# EAGLE design Board_2550 (EAGLE 7.6.0)
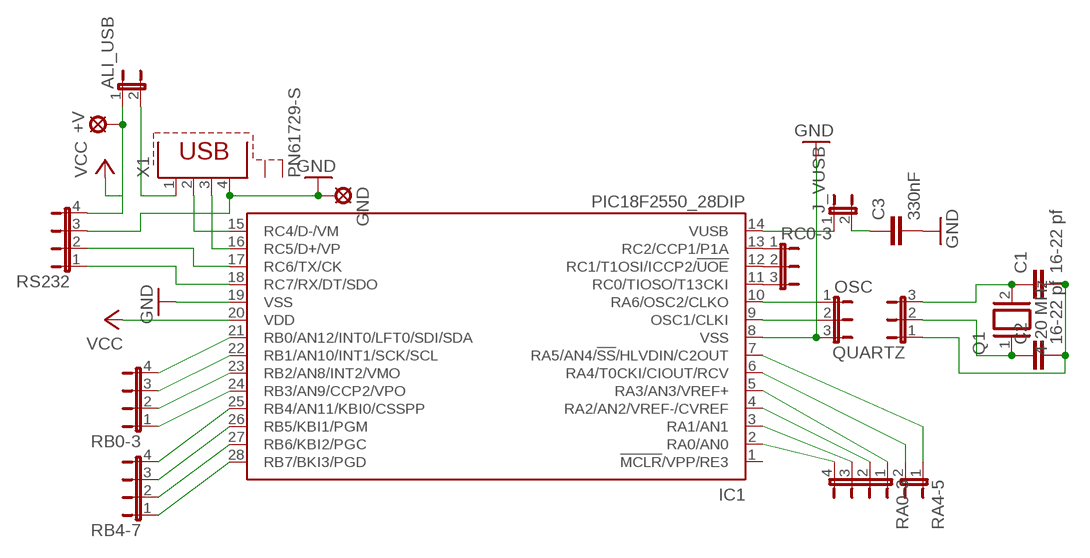
[diagram p0: schematic, sheet 1]

## Parts
+V  SE14  [SE14]
ALI_USB  JP1E  [JP1]
C1  16-22 pf  C-EU025-024X044  [C025-024X044]
C2  16-22 pf  C-EU025-024X044  [C025-024X044]
C3  330nF  C-EU025-024X044  [C025-024X044]
GND  SE14  [SE14]
IC1  PIC18F2550_28DIP  [DIL28-3]
J_VUSB  JP1E  [JP1]
OSC  JP2E  [JP2]
Q1  4-20 MHz  XTAL  [Q]
QUARTZ  JP2W  [JP2W]
RA0-3  JP4E  [JP4]
RA4-5  JP1E  [JP1]
RB0-3  JP4E  [JP4]
RB4-7  JP4E  [JP4]
RC0-3  JP2E  [JP2]
RS232  JP4E  [JP4]
X1  PN61729-S  [PN61729-S]

## Nets
GND: C3.2 GND.MP IC1.8(VSS) IC1.19(VSS) OSC.3 RS232.3 X1.4
N$1: IC1.10(RA6/OSC2/CLKO) OSC.1
N$2: IC1.9(OSC1/CLKI) OSC.2
N$3: IC1.15(RC4/D-/VM) X1.2
N$4: C1.1 Q1.2 QUARTZ.3
N$5: C2.1 Q1.1 QUARTZ.2
N$6: IC1.6(RA4/T0CKI/CIOUT/RCV) RA4-5.2
N$7: IC1.16(RC5/D+/VP) X1.3
N$8: IC1.5(RA3/AN3/VREF+) RA0-3.1
N$9: IC1.4(RA2/AN2/VREF-/CVREF) RA0-3.2
N$10: IC1.17(RC6/TX/CK) RS232.2
N$11: IC1.18(RC7/RX/DT/SDO) RS232.1
N$12: IC1.24(RB3/AN9/CCP2/VPO) RB0-3.1
N$13: IC1.23(RB2/AN8/INT2/VMO) RB0-3.2
N$14: IC1.22(RB1/AN10/INT1/SCK/SCL) RB0-3.3
N$15: IC1.21(RB0/AN12/INT0/LFT0/SDI/SDA) RB0-3.4
N$16: IC1.28(RB7/BKI3/PGD) RB4-7.1
N$17: IC1.27(RB6/KBI2/PGC) RB4-7.2
N$18: IC1.26(RB5/KBI1/PGM) RB4-7.3
N$19: IC1.25(RB4/AN11/KBI0/CSSPP) RB4-7.4
N$20: IC1.3(RA1/AN1) RA0-3.3
N$21: IC1.2(RA0/AN0) RA0-3.4
N$22: IC1.7(RA5/AN4/!SS!/HLVDIN/C2OUT) RA4-5.1
N$23: C1.2 C2.2 QUARTZ.1
N$24: +V.MP ALI_USB.1 IC1.20(VDD) RS232.4 ; supply symbol labelled VCC
N$25: IC1.13(RC2/CCP1/P1A) RC0-3.1
N$26: IC1.12(RC1/T1OSI/ICCP2/!UOE) RC0-3.2
N$27: IC1.11(RC0/TIOSO/T13CKI) RC0-3.3
N$28: C3.1 J_VUSB.2
N$29: IC1.14(VUSB) J_VUSB.1
N$30: ALI_USB.2 X1.1
Unconnected: IC1.1(!MCLR!/VPP/RE3) X1.S1 X1.S2

## Library data of the parts
+V GND = solpad:SE14: SOLDER PAD E1553, drill 1,4mm, distributor Buerklin, 07F820
ALI_USB J_VUSB RA4-5 = jumper:JP1E: JUMPER
C1-C3 = rcl:C-EU: CAPACITOR, European symbol
IC1 = microchip:PIC18F2*_28: USB Microcontrollers with nanoWatt Technology High-Performance, Enhanced Flash, 28/40/44-Pin, Source: http://ww1.microchip.com/downloads/en/devicedoc/39632c.pdf; MF: MICROCHIP; MPN: PIC18F2550-I/SP; OC_FARNELL: 1523822; OC_NEWARK: 80K6054
OSC RC0-3 = jumper:JP2E: JUMPER
Q1 = special:XTAL: CRYSTAL
QUARTZ = jumper:JP2W: JUMPER
RA0-3 RB0-3 RB4-7 RS232 = jumper:JP4E: JUMPER
X1 = con-berg:PN61729-S: BERG USB connector; OC_FARNELL: unknown; OC_NEWARK: unknown

## Board
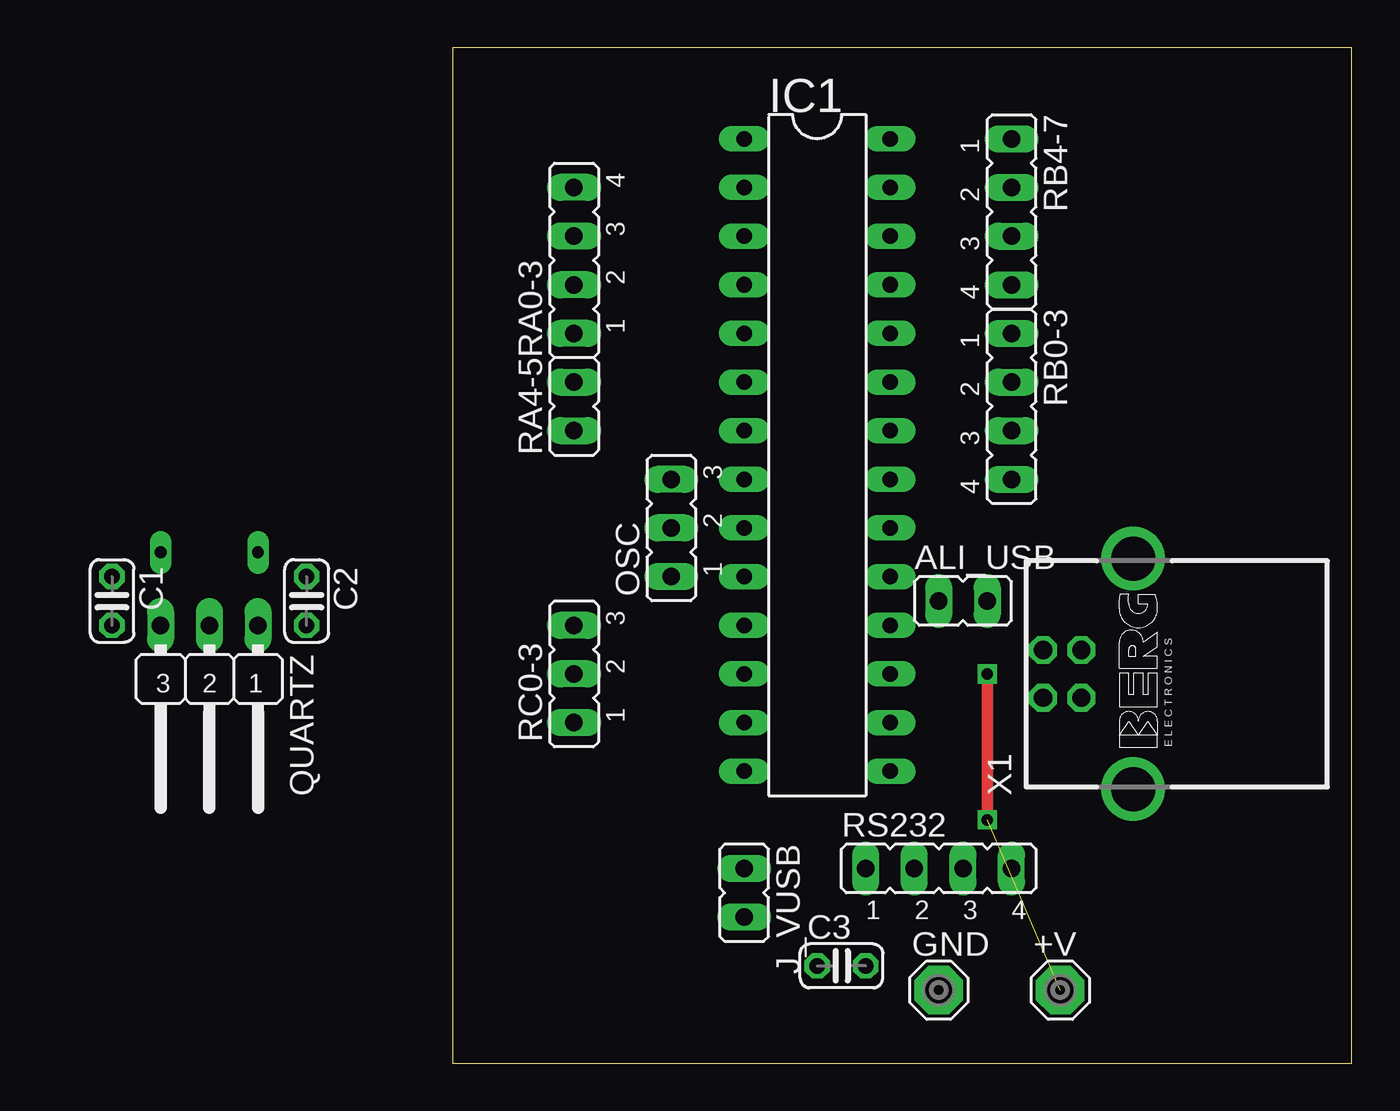
[diagram p1: board, top side]
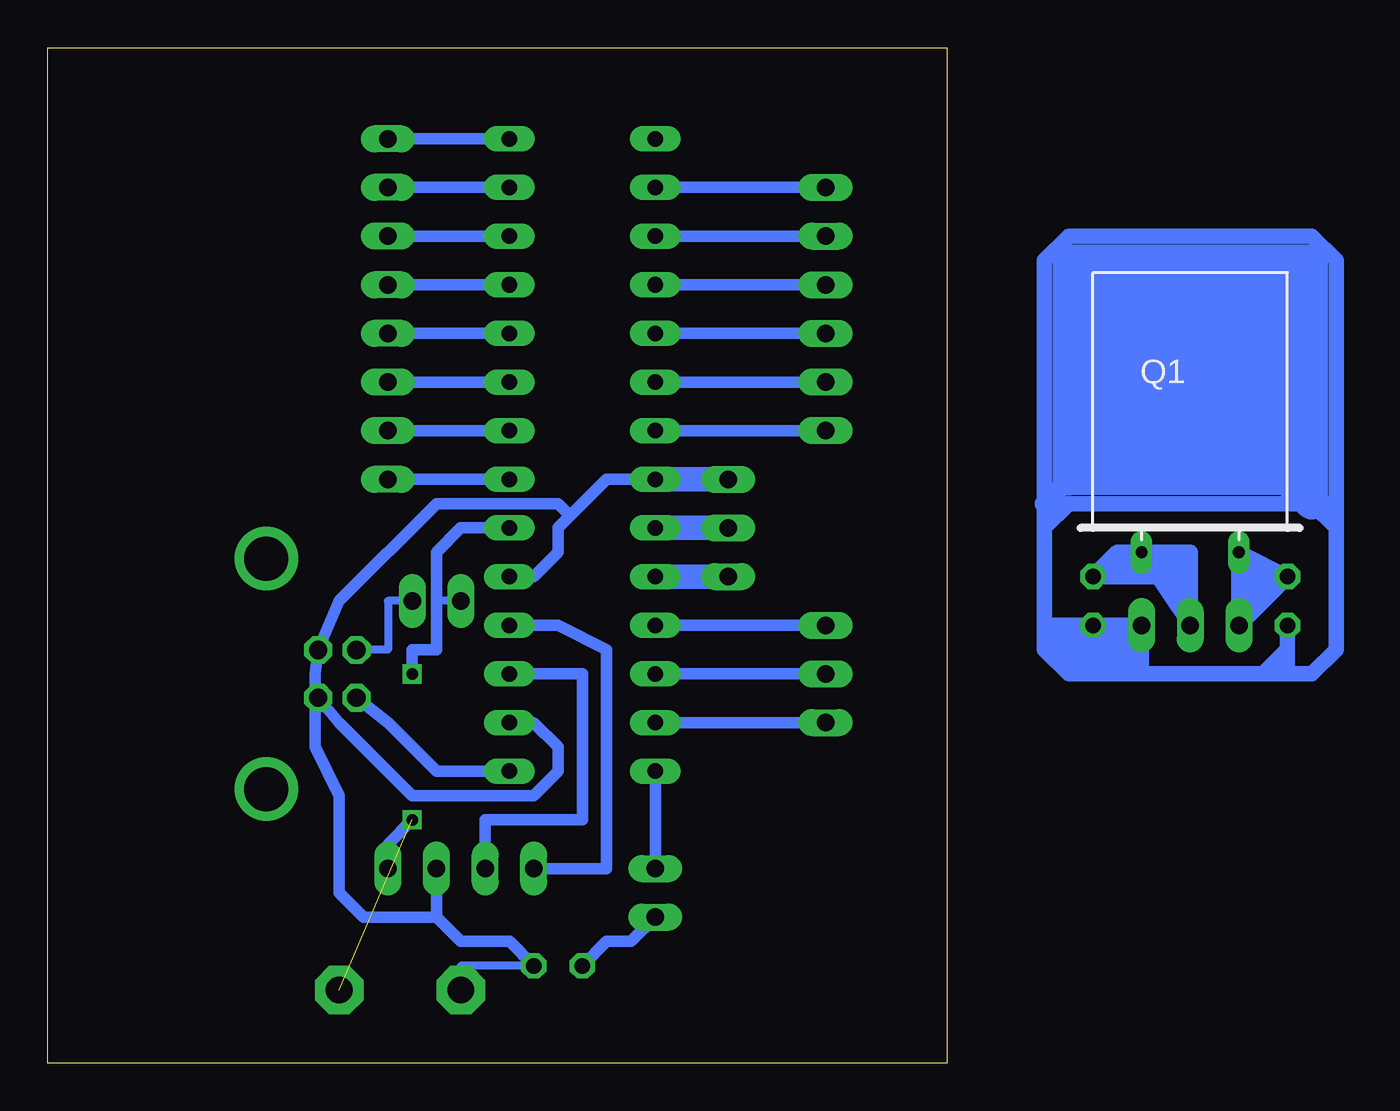
[diagram p2: board, bottom side, seen from below]

Size 46.97 x 53.01 mm. Coordinates in mm from the lower left corner, seen from the top.
Outline: 0,0 46.97,0 46.97,53.01 0,53.01 0,0
Copper layers (1*16): Top 0.035mm / dielectric 1.5mm / Bottom 0.035mm
Design rules "default": minimum track width 10mil, minimum drill 24mil, track to track 8mil, track to pad 8mil, pad to pad 8mil, via to via 8mil, smd to smd 8mil, copper to edge 40mil, drill to drill 8mil, minimum pad ring 10mil, minimum via ring 8mil, stop-mask expansion 4mil, vias tented up to drill 0mil, thermal gap 10mil

### Footprints (pad centres in the part's own frame; a part is rotated, then mirrored left to right if it is on the bottom)
SE14 = drill 1.397 pad 2.54 octagon: MP 0,0
JP1 = drill 0.914 long: 1 0,-1.27; 2 0,1.27
C025-024X044 = drill 0.813 octagon: 1 -1.27,0; 2 1.27,0
DIL28-3 = drill 0.813 long: 1 -16.51,-3.81; 2 -13.97,-3.81; 3 -11.43,-3.81; 4 -8.89,-3.81; 5 -6.35,-3.81; 6 -3.81,-3.81; 7 -1.27,-3.81; 8 1.27,-3.81; 9 3.81,-3.81; 10 6.35,-3.81; 11 8.89,-3.81; 12 11.43,-3.81; 13 13.97,-3.81; 14 16.51,-3.81; 15 16.51,3.81; 16 13.97,3.81; 17 11.43,3.81; 18 8.89,3.81; 19 6.35,3.81; 20 3.81,3.81; 21 1.27,3.81; 22 -1.27,3.81; 23 -3.81,3.81; 24 -6.35,3.81; 25 -8.89,3.81; 26 -11.43,3.81; 27 -13.97,3.81; 28 -16.51,3.81
JP2 = drill 0.914 long: 1 -2.54,0; 2 0,0; 3 2.54,0
Q = drill 0.61 long: 1 -2.54,-7.62; 2 2.54,-7.62
JP2W = drill 0.914 long: 1 -2.54,-1.27; 2 0,-1.27; 3 2.54,-1.27
JP4 = drill 0.914 long: 1 -3.81,0; 2 -1.27,0; 3 1.27,0; 4 3.81,0
PN61729-S = drill 0.95 octagon: 1 1.25,4.71; 2 -1.25,4.71; 3 -1.25,2.71; 4 1.25,2.71 | drill 2.3 pad 2.9: S1 -6.02,0; S2 6.02,0

### Placement (x,y rotation side)
+V  31.75,3.81 0 top
ALI_USB  26.67,24.13 270 top
C1  -17.78,24.13 270 top  (outside the outline)
C2  -7.62,24.13 270 top  (outside the outline)
C3  20.32,5.08 0 top
GND  25.4,3.81 0 top
IC1  19.05,31.75 270 top
J_VUSB  15.24,8.89 180 top
OSC  11.43,27.94 90 top
Q1  -12.7,34.29 0 bottom  (outside the outline)
QUARTZ  -12.7,21.59 180 top  (outside the outline)
RA0-3  6.35,41.91 90 top
RA4-5  6.35,34.29 0 top
RB0-3  29.21,34.29 270 top
RB4-7  29.21,44.45 270 top
RC0-3  6.35,20.32 90 top
RS232  25.4,10.16 0 top
X1  35.56,20.32 90 top

### Tracks (layer width: path | path; a pad name or v marks a point on that pad's centre or on a via)
GND
  Bottom 0.406: C3.2 25.4,5.08 GND.MP
  Bottom 0.61: RS232.3 26.67,7.62 | 26.67,7.62 25.4,6.35 22.86,6.35 C3.2 | IC1.8 17.78,30.48 19.68,28.58 | 19.68,28.58 20.32,27.94 20.32,26.67 21.59,25.4 IC1.19 | 26.67,7.62 30.48,7.62 31.75,8.89 31.75,13.97 33.02,16.51 33.02,20.32 X1.4 31.75,24.13 26.67,29.21 20.32,29.21 19.68,28.58
  Bottom 1.27: OSC.3 IC1.8
N$1
  Bottom 1.27: OSC.1 IC1.10
N$2
  Bottom 1.27: OSC.2 IC1.9
N$3
  Bottom 0.61: IC1.15 26.67,15.24 29.21,17.78 X1.2
N$4
  Bottom 0.813: C1.1 -16.51,24.13 | -16.51,24.13 QUARTZ.3 -15.24,24.13 | Q1.2 C1.1 | -15.24,24.13 Q1.2 | Q1.2 -15.24,25.4 -16.51,25.4 | -16.51,25.4 C1.1 | -16.51,25.4 -15.24,24.13 | -15.24,24.13 -16.51,24.13 | -16.51,24.13 -16.51,25.4 | Q1.2 -16.51,25.4
N$5
  Bottom 0.813: Q1.1 QUARTZ.2 -12.7,24.13 | -8.89,26.67 C2.1 -8.89,25.4 | -12.7,24.13 -12.7,25.4 | -12.7,25.4 -12.7,26.67 -11.43,26.67 | -11.43,26.67 Q1.1 | -11.43,25.4 -12.7,25.4 | -12.7,25.4 -11.43,26.67 | -11.43,26.67 -11.43,25.4 | -11.43,25.4 -12.7,24.13 | -8.89,25.4 -11.43,25.4 | -11.43,25.4 Q1.1 | Q1.1 -8.89,26.67 | -8.89,26.67 -8.89,25.4 | -8.89,25.4 Q1.1
N$6
  Bottom 0.61: RA4-5.2 IC1.6
N$7
  Bottom 0.61: X1.3 31.75,17.78 27.94,13.97 21.59,13.97 20.32,15.24 20.32,16.51 21.59,17.78 IC1.16
N$8
  Bottom 0.61: RA0-3.1 IC1.5
N$9
  Bottom 0.61: RA0-3.2 IC1.4
N$10
  Bottom 0.61: RS232.2 24.13,12.7 19.05,12.7 19.05,20.32 IC1.17
N$11
  Bottom 0.61: RS232.1 17.78,10.16 17.78,21.59 20.32,22.86 IC1.18
N$12
  Bottom 0.61: IC1.24 RB0-3.1
N$13
  Bottom 0.61: IC1.23 RB0-3.2
N$14
  Bottom 0.61: IC1.22 RB0-3.3
N$15
  Bottom 0.61: IC1.21 RB0-3.4
N$16
  Bottom 0.61: IC1.28 RB4-7.1
N$17
  Bottom 0.61: IC1.27 RB4-7.2
N$18
  Bottom 0.61: IC1.26 RB4-7.3
N$19
  Bottom 0.61: IC1.25 RB4-7.4
N$20
  Bottom 0.61: RA0-3.3 IC1.3
N$21
  Bottom 0.61: RA0-3.4 IC1.2
N$22
  Bottom 0.61: RA4-5.1 IC1.7
N$23
  Bottom 0.813: C1.2 -17.78,21.59 | -17.78,21.59 -17.78,20.32 | -17.78,20.32 -16.51,20.32 | -16.51,20.32 -10.16,20.32 | -10.16,20.32 -10.16,21.59 | -10.16,21.59 QUARTZ.1 -8.89,22.86 | C2.2 -8.89,22.86 | -17.78,21.59 -16.51,20.32 | -10.16,20.32 -8.89,21.59 | C2.2 -8.89,21.59 | -10.16,21.59 -8.89,22.86 | -10.16,21.59 -8.89,21.59 | -8.89,21.59 -8.89,22.86 | -17.78,20.32 -19.05,20.32 -20.32,21.59 -20.32,27.94 | -20.32,27.94 -20.32,29.21 | -20.32,29.21 -20.32,41.91 -19.05,43.18 -6.35,43.18 -5.08,41.91 -5.08,29.21 | -5.08,27.94 -5.08,22.86 | -5.08,22.86 -5.08,21.59 | -5.08,21.59 -6.35,20.32 | -6.35,20.32 -7.62,20.32 | -7.62,20.32 -8.89,20.32 | -8.89,20.32 -10.16,20.32 | C2.2 -6.35,22.86 | -6.35,22.86 -5.08,22.86 | -5.08,22.86 -6.35,21.59 | -7.62,21.59 -8.89,21.59 | -8.89,21.59 -8.89,20.32 | -8.89,20.32 -7.62,21.59 | -6.35,21.59 -5.08,21.59 | -6.35,21.59 -7.62,21.59 | -7.62,21.59 -7.62,20.32 | -7.62,20.32 -6.35,21.59 | -6.35,21.59 C2.2 | C2.2 -7.62,21.59 | -6.35,22.86 -6.35,20.32 | -20.32,29.21 -19.05,29.21 | -19.05,29.21 -6.35,29.21 | -6.35,29.21 -5.08,29.21 | -5.08,29.21 -5.08,27.94 | -5.08,27.94 -6.35,29.21 | -19.05,29.21 -20.32,27.94
  Bottom 1.016: -6.35,30.48 -5.08,29.21
  Bottom 1.676: -19.05,30.48 -17.78,30.48 | -6.35,30.48 -6.35,41.91 -19.05,41.91 -19.05,29.21 -17.78,30.48 | -17.78,30.48 -6.35,30.48 | -6.35,30.48 -7.62,31.75 -17.78,31.75 -17.78,40.64 -7.62,40.64 -7.62,33.02 -16.51,33.02 -16.51,39.37 -8.89,39.37 -8.89,34.29 -15.24,34.29 -15.24,38.1 -10.16,38.1 -10.16,35.56 -13.97,35.56 -13.97,36.83 -11.43,36.83
N$24  (via drill 0.6)  (1 unrouted)
  Top 0.61: v27.94,20.32 v27.94,12.7
  Bottom 0.406: ALI_USB.1 26.67,24.13
  Bottom 0.61: v27.94,12.7 29.21,11.43 RS232.4 | IC1.20 25.4,27.94 26.67,26.67 26.67,24.13 26.67,21.59 27.94,21.59 v27.94,20.32
N$25
  Bottom 0.61: RC0-3.1 IC1.13
N$26
  Bottom 0.61: RC0-3.2 IC1.12
N$27
  Bottom 0.61: RC0-3.3 IC1.11
N$28
  Bottom 0.61: J_VUSB.2 16.51,6.35 17.78,6.35 C3.1
N$29
  Bottom 0.61: IC1.14 J_VUSB.1
N$30
  Bottom 0.406: ALI_USB.2 29.21,24.13 29.21,21.59 30.85,21.59 X1.1